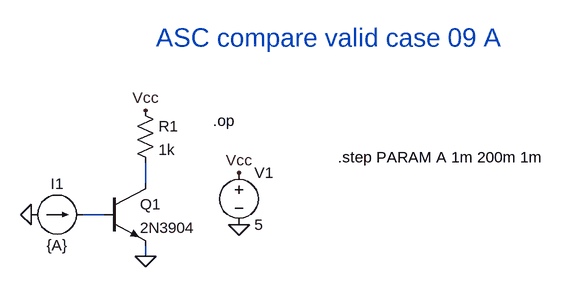
[diagram p0: schematic valid_case_09_a.asc]
valid_case_09_a.asc, the LTspice schematic file:
Version 4.1
SHEET 1 976 680
WIRE 160 96 160 64
WIRE 96 144 64 144
WIRE 160 208 160 192
FLAG 160 -16 Vcc
FLAG 304 80 Vcc
FLAG -16 144 0
FLAG 160 208 0
FLAG 304 160 0
SYMBOL current -16 144 R270
WINDOW 0 32 40 VTop 2
WINDOW 3 -32 40 VBottom 2
WINDOW 123 0 0 Left 2
WINDOW 39 0 0 Left 2
SYMATTR InstName I1
SYMATTR Value {A}
SYMBOL npn 96 96 R0
SYMATTR InstName Q1
SYMATTR Value 2N3904
SYMBOL voltage 304 64 R0
WINDOW 123 0 0 Left 2
WINDOW 39 0 0 Left 2
SYMATTR InstName V1
SYMATTR Value 5
SYMBOL res 144 -32 R0
SYMATTR InstName R1
SYMATTR Value 1k
TEXT 456 56 Left 2 !.step PARAM A 1m 200m 1m
TEXT 264 0 Left 2 !.op
TEXT 176 -128 Left 4 ;ASC compare valid case 09 A

The netlist it stands for:
* valid_case_09_a.asc
I1 0 N002 {A}
Q1 N001 N002 0 0 2N3904
V1 Vcc 0 5
R1 Vcc N001 1k
.model NPN NPN
.model PNP PNP
.lib standard.bjt
.step PARAM A 1m 200m 1m
.op
* ASC compare valid case 09 A
.backanno
.end